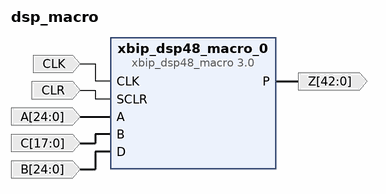
[diagram p0: block diagram of the top level]
# Vivado block design dsp_macro, xc7z020clg484-1, Vivado 2018.1
create_bd_design dsp_macro

create_bd_port -dir O -from 42 -to 0 -type data Z
create_bd_port -dir I -type clk CLK
create_bd_port -dir I -type rst CLR
set_property -dict {CONFIG.POLARITY ACTIVE_HIGH} [get_bd_ports CLR]
create_bd_port -dir I -from 24 -to 0 -type data A
create_bd_port -dir I -from 17 -to 0 -type data C
create_bd_port -dir I -from 24 -to 0 -type data B

create_bd_cell -type ip -vlnv xilinx.com:ip:xbip_dsp48_macro:3.0 xbip_dsp48_macro_0
set_property -dict [list \
  CONFIG.instruction1 {B*(D+A)} \
  CONFIG.dreg_3 true \
  CONFIG.areg_3 true \
  CONFIG.areg_4 true \
  CONFIG.breg_3 true \
  CONFIG.breg_4 true \
  CONFIG.creg_3 false \
  CONFIG.creg_4 false \
  CONFIG.creg_5 false \
  CONFIG.mreg_5 true \
  CONFIG.preg_6 true \
  CONFIG.d_width 25 \
  CONFIG.d_binarywidth 0 \
  CONFIG.a_width 25 \
  CONFIG.a_binarywidth 0 \
  CONFIG.b_width 18 \
  CONFIG.b_binarywidth 0 \
  CONFIG.concat_width 48 \
  CONFIG.concat_binarywidth 0 \
  CONFIG.c_binarywidth 0 \
  CONFIG.pcin_binarywidth 0 \
  CONFIG.p_full_width 43 \
  CONFIG.p_width 43 \
  CONFIG.p_binarywidth 0 \
  CONFIG.has_sclr true \
] [get_bd_cells xbip_dsp48_macro_0]

# ---- connections ----

connect_bd_net [get_bd_pins xbip_dsp48_macro_0/P] [get_bd_ports Z]
connect_bd_net -net CLK_0_1 [get_bd_ports CLK] [get_bd_pins xbip_dsp48_macro_0/CLK]
connect_bd_net -net SCLR_0_1 [get_bd_ports CLR] [get_bd_pins xbip_dsp48_macro_0/SCLR]
connect_bd_net -net A_0_1 [get_bd_ports A] [get_bd_pins xbip_dsp48_macro_0/A]
connect_bd_net -net B_0_1 [get_bd_ports C] [get_bd_pins xbip_dsp48_macro_0/B]
connect_bd_net -net D_0_1 [get_bd_ports B] [get_bd_pins xbip_dsp48_macro_0/D]

validate_bd_design
save_bd_design
